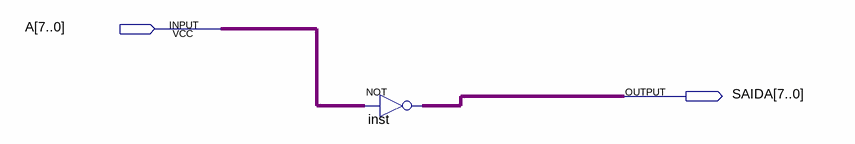
[diagram p0: schematic sheet]
// Quartus schematic not8bits.bdf as structural Verilog: 1 symbols, 2 pins
module not8bits (
  input  [7:0] A,
  output [7:0] SAIDA
);

  assign SAIDA = ~A;  // NOT inst, 8 bits wide
endmodule
